# Altium schematic sheet wireless.SchDoc: Bison-Board
size A4; DrawnBy: mzy2364; Revision: V1.4
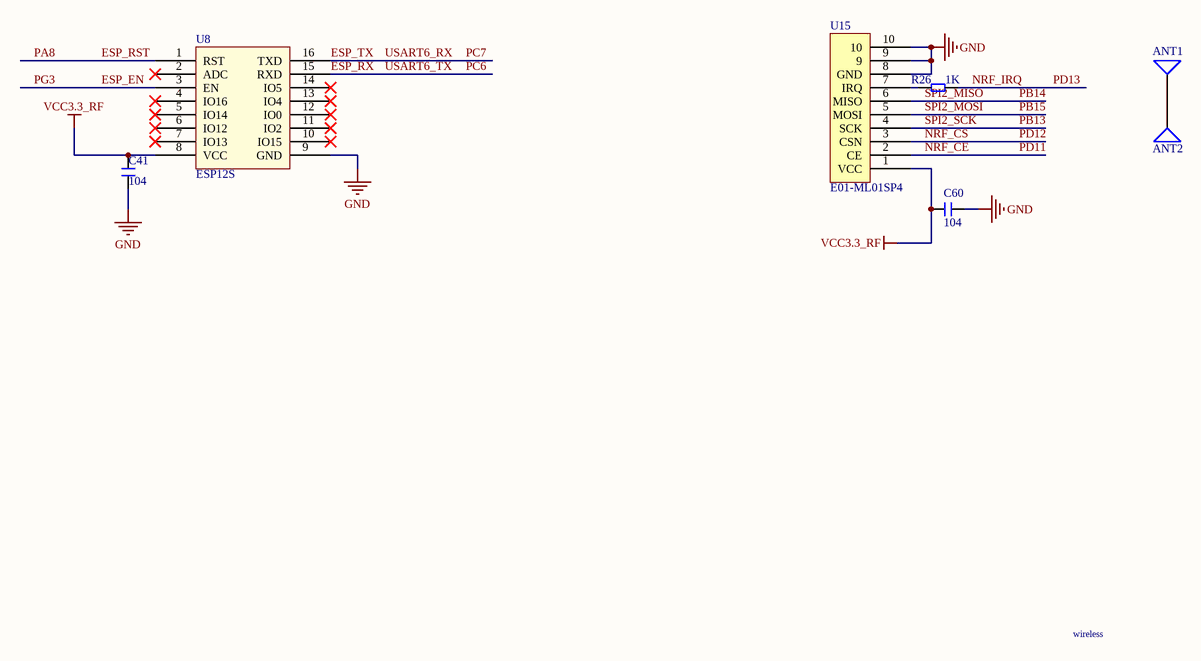
[diagram p0: wireless.SchDoc]

## Parts
ANT1  ANT1  [ANT-SMA-KE]  (value not drawn)
ANT2  ANT  [ANT IPEX]  (value not drawn)
C41  104  [C 0603]
C60  104  [C 0603]
R26  1K  [R 0603]
U8  ESP12S  [ESP12S]
U15  E01-ML01SP4  [E01-ML01SP4]

## Nets
GND: C41.1 C60.2 U8.9(GND) U15.8(GND) U15.9 U15.10
VCC3.3_RF: C41.2 C60.1 U8.8(VCC) U15.1(VCC)
ESP_EN: U8.3(EN)  [also labelled PG3]
ESP_RST: U8.1(RST)  [also labelled PA8]
ESP_RX: U8.15(RXD)  [also labelled PC6, USART6_TX]
ESP_TX: U8.16(TXD)  [also labelled PC7, USART6_RX]
NRF_CE: U15.2(CE)  [also labelled PD11]
NRF_CS: U15.3(CSN)  [also labelled PD12]
NRF_IRQ: R26.1  [also labelled PD13]
PB13: U15.4(SCK)  [also labelled SPI2_SCK]
PB14: U15.6(MISO)  [also labelled SPI2_MISO]
PB15: U15.5(MOSI)  [also labelled SPI2_MOSI]
NetANT1_1: ANT1.1 ANT2.1
NetR26_2: R26.2 U15.7(IRQ)

Not connected (* = marked no-connect by the designer): U8 2(ADC)* 4(IO16)* 5(IO14)* 6(IO12)* 7(IO13)* 10(IO15)* 11(IO2)* 12(IO0)* 13(IO4)* 14(IO5)*

## Notes on the sheet
- wireless

## Library data of the parts
ANT1 = ANT
C41 C60 = CAP
R26 = RES
U8 = ESP12S: WIFI模块
U15 = 24L01: 2.4G无限模块